# Altium project panda_band_simple.PrjPcb
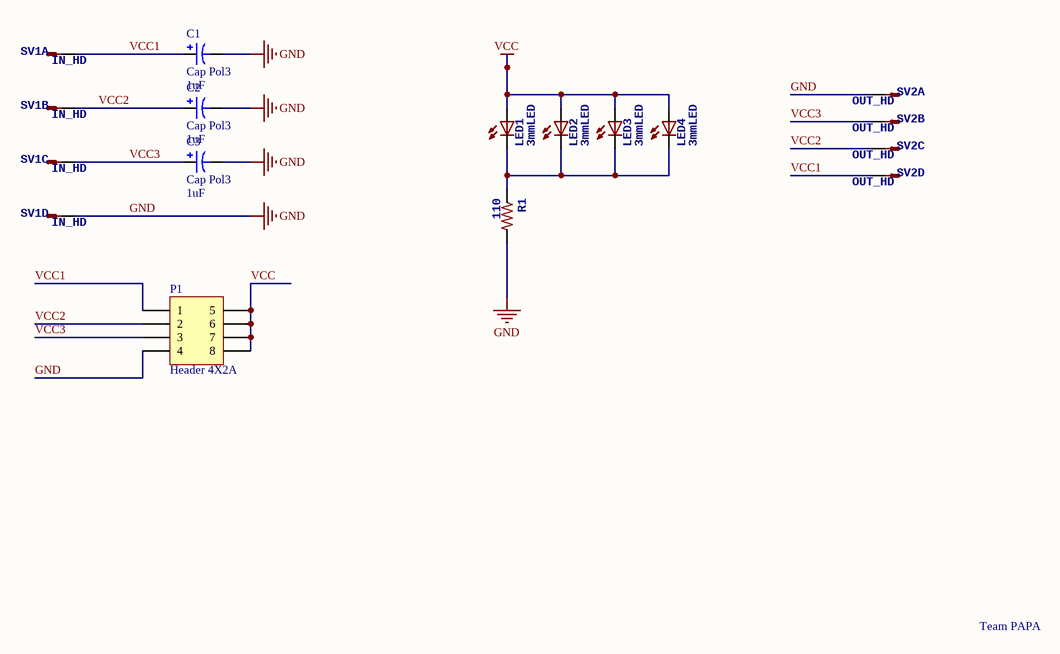
[diagram p0: node_simple.SchDoc]
1 sheet, 11 parts. Net scope: global (net labels, ports and power ports of the same name join across sheets).
Board file: node_simple.PcbDoc

## Sheet node_simple.SchDoc: Snake-band
size A; DrawnBy: Hengjiu Kang; Revision: 1; SheetNumber: 1; SheetTotal: 1; DocumentName: Snake-band; ProjectName: NaughtyBall

### Parts
C1  Cap Pol3  value 1uF  [C0805]
C2  Cap Pol3  value 1uF  [C0805]
C3  Cap Pol3  value 1uF  [C0805]
LED1  3mmLED  [led3mm]
LED2  3mmLED  [led3mm]
LED3  3mmLED  [led3mm]
LED4  3mmLED  [led3mm]
P1  Header 4X2A  [HDR2X4_CEN]
R1  110  [M0805]
SV1  IN_HD  [L04P]  (parts A,B,C,D of 4)
SV2  OUT_HD  [L04P]  (parts A,B,C,D of 4)

### Nets
GND: C1.2 C2.2 C3.2 P1.4 R1.2 SV1.4(S) SV2.1(S)
VCC: LED1.A LED2.A LED3.A LED4.A P1.5 P1.6 P1.7 P1.8
VCC1: C1.1 P1.1 SV1.1(S) SV2.4(S)
VCC2: C2.1 P1.2 SV1.2(S) SV2.3(S)
VCC3: C3.1 P1.3 SV1.3(S) SV2.2(S)
NetLED1_K: LED1.K(C) LED2.K(C) LED3.K(C) LED4.K(C) R1.1

### Notes on the sheet
- Team PAPA

### Library data of the parts
C1-C3 = Cap Pol3: Polarized Capacitor (Surface Mount); Published: 8-Jun-2000; LatestRevisionDate: 29-May-2009; LatestRevisionNote: IPC-7351 Footprint Added.; PackageReference: C0805; Publisher: Altium Limited; PackageDescription: Chip Capacitor
LED1-LED4 = LED3MM
P1 = Header 4X2A: Header, 4-Pin, Dual row; LatestRevisionDate: 17-Jul-2002; LatestRevisionNote: Re-released for DXP Platform.; Publisher: Altium Limited
R1 = R-US_M0805: R-M0805; value: 4.7k
SV1 SV2 = L04P: OC_FARNELL: unknown; OC_NEWARK: unknown